# Altium schematic sheet Display.SchDoc: DISPLAY
size A4; Date: 30 08 2013; Author: Rachid AKKOUCHE; CompanyName: RASoftware; DrawnBy: Rachid AKKOUCHE; Engineer: Rachid AKKOUCHE; Organization: RASoftware; Address1: 52 J03, rue de la crèche; Address2: 77100 MEAUX; Address3: FRANCE; DocumentNumber: BRA201308307C; Revision: C; SheetNumber: 7; SheetTotal: 11; Telephone: +33651604047; Email: rachid.akkouche@wanadoo.fr; Proprietaire: MDI System; Dessinepar: -; Verifiepar: -; PageSetup: Record=PageOptions|CenterHorizontal=True|CenterVertical=True|PrintScale=1.00|XCorrection=1.00|YCorrection=1.00|PrintKind=1|BorderSize=5000000|LeftOffset=0|BottomOffset=0|Orientation=2|PaperLength=1000|PaperWidth=1000|Scale=100|PaperSource=1|PrintQuality=-3|MediaType=1|DitherType=10|PrintScaleMode=1|PaperKind=16K|PaperIndex=409; Time: 19:00
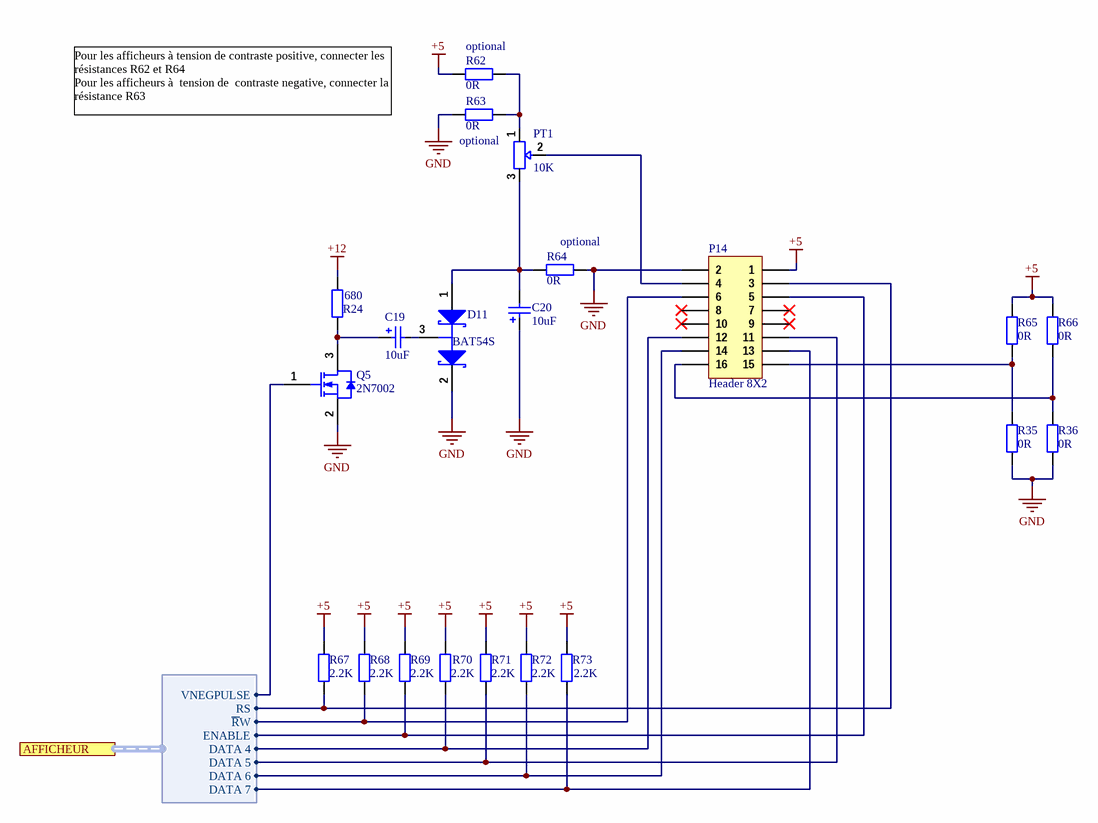
[diagram p0: Display.SchDoc]

## Parts
C19  10uF  [KEMET_4]
C20  10uF  [KEMET_4]
D11  BAT54S  [SOT-23]
P14  Header 8X2  [M20-2X8]
PT1  10K  [3361P]
Q5  2N7002  [SOT23]
R24  680  [R0805]
R35  0R  [R0805]
R36  0R  [R0805]
R62  0R  [R0805]
R63  0R  [R0805]
R64  0R  [R0805]
R65  0R  [R0805]
R66  0R  [R0805]
R67  2.2K  [R0805]
R68  2.2K  [R0805]
R69  2.2K  [R0805]
R70  2.2K  [R0805]
R71  2.2K  [R0805]
R72  2.2K  [R0805]
R73  2.2K  [R0805]

## Ports
AFFICHEUR (harness IO DISPLAY)

## Harnesses
IO DISPLAY: DATA 4, DATA 5, DATA 6, DATA 7, ENABLE, ~{R}W, RS, VNEGPULSE

## Nets
+5: P14.1 R62.2 R65.2 R66.2 R67.2 R68.2 R69.2 R70.2 R71.2 R72.2 R73.2
+12: R24.2
GND: C20.1 D11.2(K) P14.2 Q5.2(S) R35.1 R36.1 R63.2 R64.1
NetC19_1: C19.1 Q5.3(D) R24.1
NetC19_2: C19.2 D11.3(C)
NetC20_2: C20.2 D11.1(A) PT1.3 R64.2
NetP14_3: P14.3 R67.1 ; port AFFICHEUR.RS
NetP14_4: P14.4 PT1.2
NetP14_5: P14.5 R69.1 ; port AFFICHEUR.ENABLE
NetP14_6: P14.6 R68.1 ; port AFFICHEUR.~{R}W
NetP14_11: P14.11 R71.1 ; port AFFICHEUR.DATA 5
NetP14_12: P14.12 R70.1 ; port AFFICHEUR.DATA 4
NetP14_13: P14.13 R73.1 ; port AFFICHEUR.DATA 7
NetP14_14: P14.14 R72.1 ; port AFFICHEUR.DATA 6
NetP14_15: P14.15 R35.2 R65.1
NetP14_16: P14.16 R36.2 R66.1
NetPT1_1: PT1.1 R62.1 R63.1
NetQ5_1: Q5.1(G) ; port AFFICHEUR.VNEGPULSE

Not connected (* = marked no-connect by the designer): P14 7* 8* 9* 10*

## Notes on the sheet
- (near R62) optional
- Pour les afficheurs à tension de contraste positive, connecter les résistances R62 et R64
  Pour les afficheurs à  tension de  contraste negative, connecter la résistance R63
- optional
- (near R64) optional
- Ce document est la propriété de
- Project:
- Il ne peut être divulgué sans l'accord écrit de l'un de ses représentants dûment mandaté
- Title:
- Number:
- Date:
- Time:
- Size:
- A4
- Revision:
- Sheet
- of
- 52 J03 rue de la crèche
- Draw by:
- 77100 Meaux

## Library data of the parts
C19 C20 = Cap Pol 10uF: Polarized Capacitor; Manufacturer: KEMET; Manufacturer Part Number: EXV106M025A9BAA; Supplier 1: Farnell; Supplier Part Number 1: 2069174; RoHS: YES; Pricing 1: 10=0,111, 100=0,085, 500=0,074, 1000=0,07, 5000=0,066 (EUR); ComponentLink1URL: http://www.farnell.com/datasheets/1500293.pdf; ComponentLink1Description: http://www.farnell.com/datasheets/1500293.pdf
D11 = BAT54S: Schottky Barrier Double Diode; Manufacturer: MULTICOMP; Published: 17-Sep-2003; LatestRevisionDate: 12-Dec-2006; LatestRevisionNote: IPC-7351 Footprint Added.; DatasheetVersion: 4-Mar-2002; PackageVersion: May-1999; PackageReference: SOT23; Publisher: Altium Limited; PackageDescription: 3-Pin SOT-23 Package 0.95 mm Pitch, 2.3 mm Lead Span; ComponentLink1Description: Manufacturer Link; ComponentLink1URL: http://www.semiconductors.philips.com/; ComponentLink2Description: Datasheet; ComponentLink2URL: http://www.semiconductors.philips.com/acrobat/datasheets/BAT54_SERIES_4.pdf; Supplier 1: Farnell; Supplier Part Number 1: 1621835; Manufacturer Part Number: BAT54S; RoHS: YES; Stock 1: 51548; Pricing 1: 10=0,102, 250=0,074, 1000=0,06, 3000=0,053 (EUR); ComponentLink3URL: http://www.farnell.com/datasheets/1317753.pdf; ComponentLink3Description: http://www.farnell.com/datasheets/1317753.pdf
P14 = Header 8X2: Header, 8-Pin, Dual row; Manufacturer: HARWIN; Manufacturer Part Number: M20-8760842; LatestRevisionDate: 17-Jul-2002; LatestRevisionNote: Re-released for DXP Platform.; Publisher: Altium Limited; Supplier 1: Farnell; Supplier Part Number 1: 1517392; RoHS: YES; Pricing 1: 10=1,4, 20=1,39, 50=1,38, 100=1,37, 250=1,33, 500=1,26 (EUR); ComponentLink1URL: http://www.farnell.com/datasheets/1089519.pdf; ComponentLink1Description: http://www.farnell.com/datasheets/1089519.pdf; ComponentLink2URL: http://www.farnell.com/datasheets/5481.pdf; ComponentLink2Description: http://www.farnell.com/datasheets/5481.pdf
PT1 = RV: Manufacturer: BOURNS; Manufacturer Part Number: 3361P-1-103GLF; Supplier 1: Farnell; Supplier Part Number 1: 1696060; RoHS: YES; Pricing 1: 5=0,79, 50=0,74, 100=0,67, 250=0,63, 750=0,58 (EUR); ComponentLink1URL: http://www.farnell.com/datasheets/1563530.igs; ComponentLink1Description: http://www.farnell.com/datasheets/1563530.igs; ComponentLink2URL: http://www.farnell.com/datasheets/1443095.pdf; ComponentLink2Description: http://www.farnell.com/datasheets/1443095.pdf; ComponentLink3URL: http://www.farnell.com/cad/1563578.stp; ComponentLink3Description: http://www.farnell.com/cad/1563578.stp
Q5 = 2N7002: N-channel Enhancement Mode Field-effect Transistor; Manufacturer: NXP; Published: 17-Sep-2003; LatestRevisionDate: 12-Dec-2006; LatestRevisionNote: IPC-7351 Footprint Added.; DatasheetVersion: 27-Jul-2000; PackageVersion: May-1999; PackageReference: SOT23; Publisher: Altium Limited; PackageDescription: 3-Pin SOT-23 Package 0.95 mm Pitch, 2.3 mm Lead Span; ComponentLink1Description: Manufacturer Link; ComponentLink1URL: http://www.semiconductors.philips.com/; ComponentLink2Description: Datasheet; ComponentLink2URL: http://www.semiconductors.philips.com/acrobat/datasheets/2N7002_4.pdf; Supplier 1: Farnell; Supplier Part Number 1: 1510761; Manufacturer Part Number: 2N7002; RoHS: YES; Stock 1: 14389; Pricing 1: 5=0,177, 25=0,118, 100=0,044, 1000=0,037, 3000=0,028 (EUR); ComponentLink3URL: http://www.nxp.com/documents/spice_model/2N7002.LIB; ComponentLink3Description: http://www.nxp.com/documents/spice_model/2N7002.LIB; ComponentLink4URL: http://beta.nxp.com/documents/data_sheet/2N7002PV.pdf; ComponentLink4Description: http://beta.nxp.com/documents/data_sheet/2N7002PV.pdf
R24 = Resistor 0805 680: Resistor
R35 R36 R62-R66 = Resistor 0805 0R: Resistor or Jumper; Manufacturer: MULTICOMP; Manufacturer Part Number: MCMR08X000 PTL; Product Range: MULTICOMP - MCMR Series; Résistance: 0; Puissance: 125; Tolérance de résistance: ± 0.05; Type de boîtier de résistance: 0805; Type de résistance: Céramique; Coefficient de température: -200ppm/°C à +400; Tension: 150; Type de packaging: Cut Tape; Resistor Mounting: CMS; Supplier 1: Farnell; Supplier Part Number 1: 2073603; RoHS: YES; Pricing 1: 100=0,011, 500=0,009, 1000=0,008 (EUR); MSL: MSL 1 - Illimité; ComponentLink1URL: http://www.farnell.com/datasheets/1716708.pdf; ComponentLink1Description: http://www.farnell.com/datasheets/1716708.pdf
R67-R73 = Resistor 0805 2.2K: Resistor; Manufacturer: MULTICOMP; Manufacturer Part Number: MC01W080512K2; Supplier 1: Farnell; RoHS: YES; Pricing 1: 5000=0,001 (EUR); ComponentLink1URL: http://www.farnell.com/datasheets/1729047.pdf; ComponentLink1Description: http://www.farnell.com/datasheets/1729047.pdf; Supplier Part Number 1: 2129138